# Altium schematic sheet Flash.SchDoc
size A4; SheetNumber: 6; SheetTotal: 8
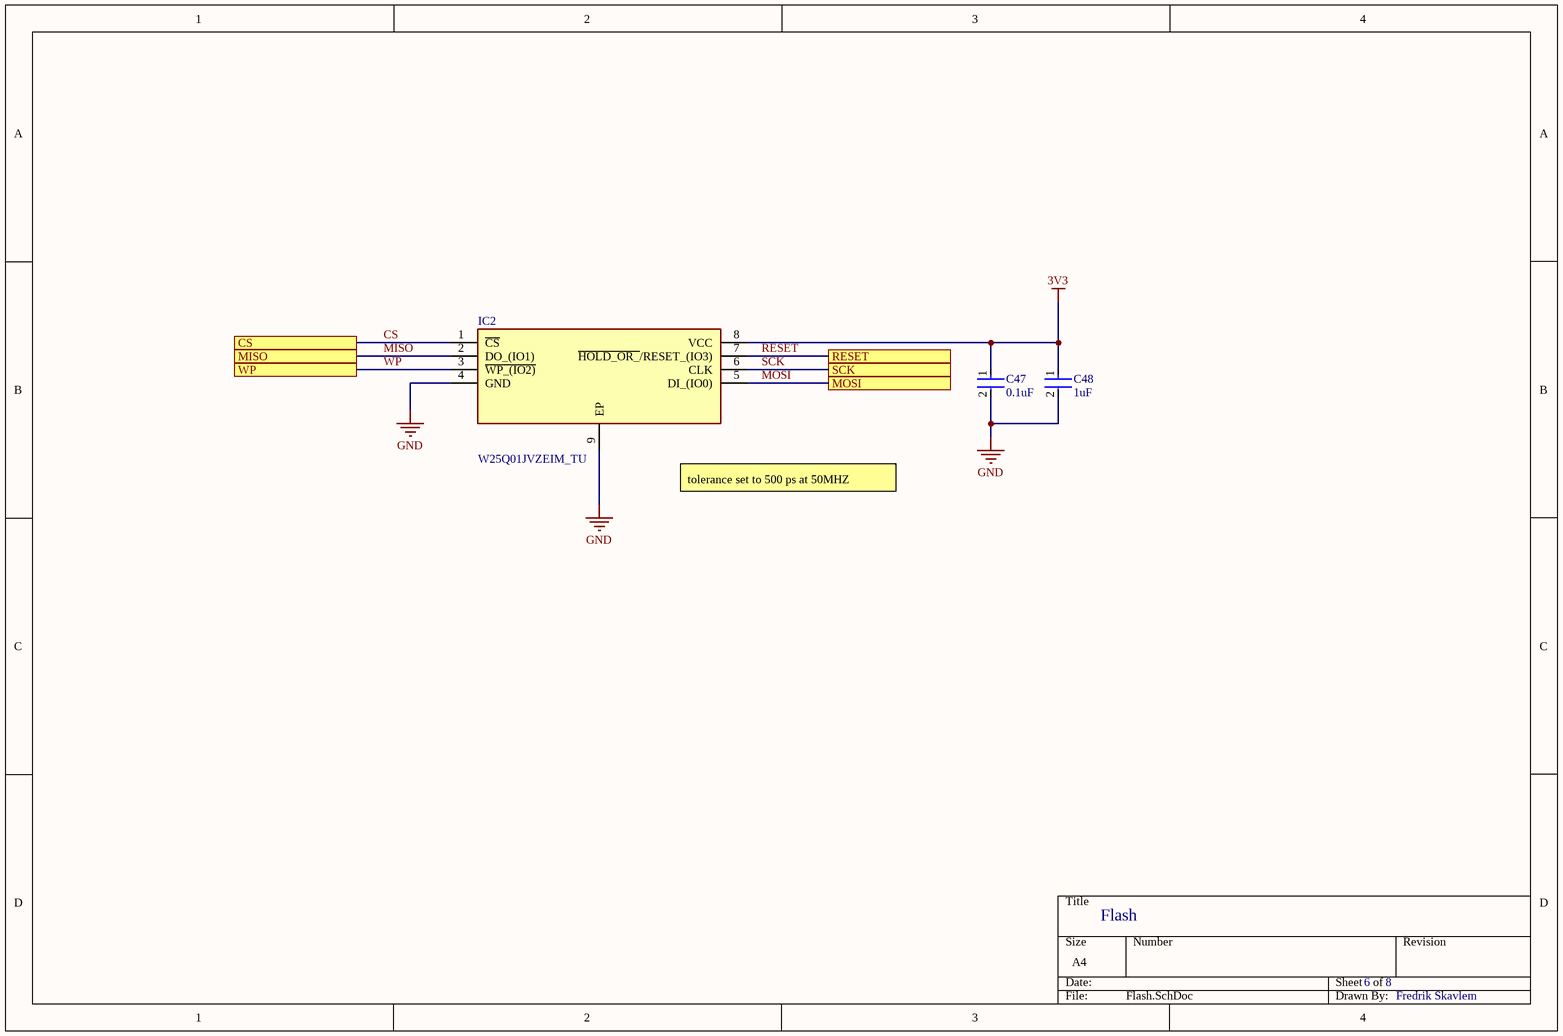
[diagram p0: Flash.SchDoc]

## Parts
C47  0.1uF  [FP-CL10-IPC_C]
C48  1uF  [FP-CL10-IPC_C]
IC2  W25Q01JVZEIM_TU  [SON127P800X600X80-9N-D]

## Ports
CS, MISO, MOSI, RESET, SCK, WP

## Nets
3V3: C47.1 C48.1 IC2.8(VCC)
GND: C47.2 C48.2 IC2.4(GND) IC2.9(EP)
CS: IC2.1(~{CS}) ; port CS
MISO: IC2.2(DO_(IO1)) ; port MISO
MOSI: IC2.5(DI_(IO0)) ; port MOSI
RESET: IC2.7(~{HOLD_OR_}/RESET_(IO3)) ; port RESET
SCK: IC2.6(CLK) ; port SCK
WP: IC2.3(~{WP_(IO2)}) ; port WP

## Notes on the sheet
- (near IC2) tolerance set to 500 ps at 50MHZ
- Flash
- 6
- 8
- Fredrik Skavlem

## Library data of the parts
C47 = CMP-13271-002683-1: Cap Ceramic 100nF 16V X7R ±10% Pad SMD 0603 +125°C T/R / CL10B104KO8WPNC; Voltage Rating: 16V; Max Operating Temperature: 125°C; Capacitance: 100nF; Features: Soft Termination; Length: 0.063inch; Packaging: Tape and Reel; Min Operating Temperature: -55°C; Mount: Surface Mount; Case/Package: 0603; Case Code (Metric): 1608; Width: 0.031inch; Ratings: AEC-Q200; Thickness: 0.035inch; Case Code (Imperial): 0603; Tolerance: 10%
C48 = CMP-13271-000784-1: Cap Ceramic 1uF 16V X7R ±10% Pad SMD 0603 +125°C T/R / CL10B105KO8NNNL; Mount: Surface Mount; Case/Package: 0603; Capacitance: 1uF; Package Quantity: 15000; Tolerance: 10%; Height: 0.8mm; Thickness: 0.035inch; Length: 1.6mm; Lead Free: Lead Free; Depth: 0.8mm; Radiation Hardening: No; Voltage Rating: 16V; Max Operating Temperature: 125°C; Min Operating Temperature: -55°C; Dielectric: X7R; Voltage Rating (DC): 16V; Packaging: Tape and Reel; Width: 0.031inch
IC2 = W25Q01JVZEIM_TU: Integrated Circuit; Manufacturer_Name: Winbond; Manufacturer_Part_Number: W25Q01JVZEIM TU; Datasheet Link: https://www.mouser.jp/datasheet/2/949/W25Q01JV_SPI_RevB_11132019-1760416.pdf; Height: 0.8mm; Mouser Part Number: 454-W25Q01JVZEIMTU; Mouser Price/Stock: https://www.mouser.co.uk/ProductDetail/Winbond/W25Q01JVZEIM-TU/?qs=YwPsRIUVAOcsCshGUAsYXg%3D%3D